# EAGLE design ADC_1_0 (EAGLE 7.6.0)
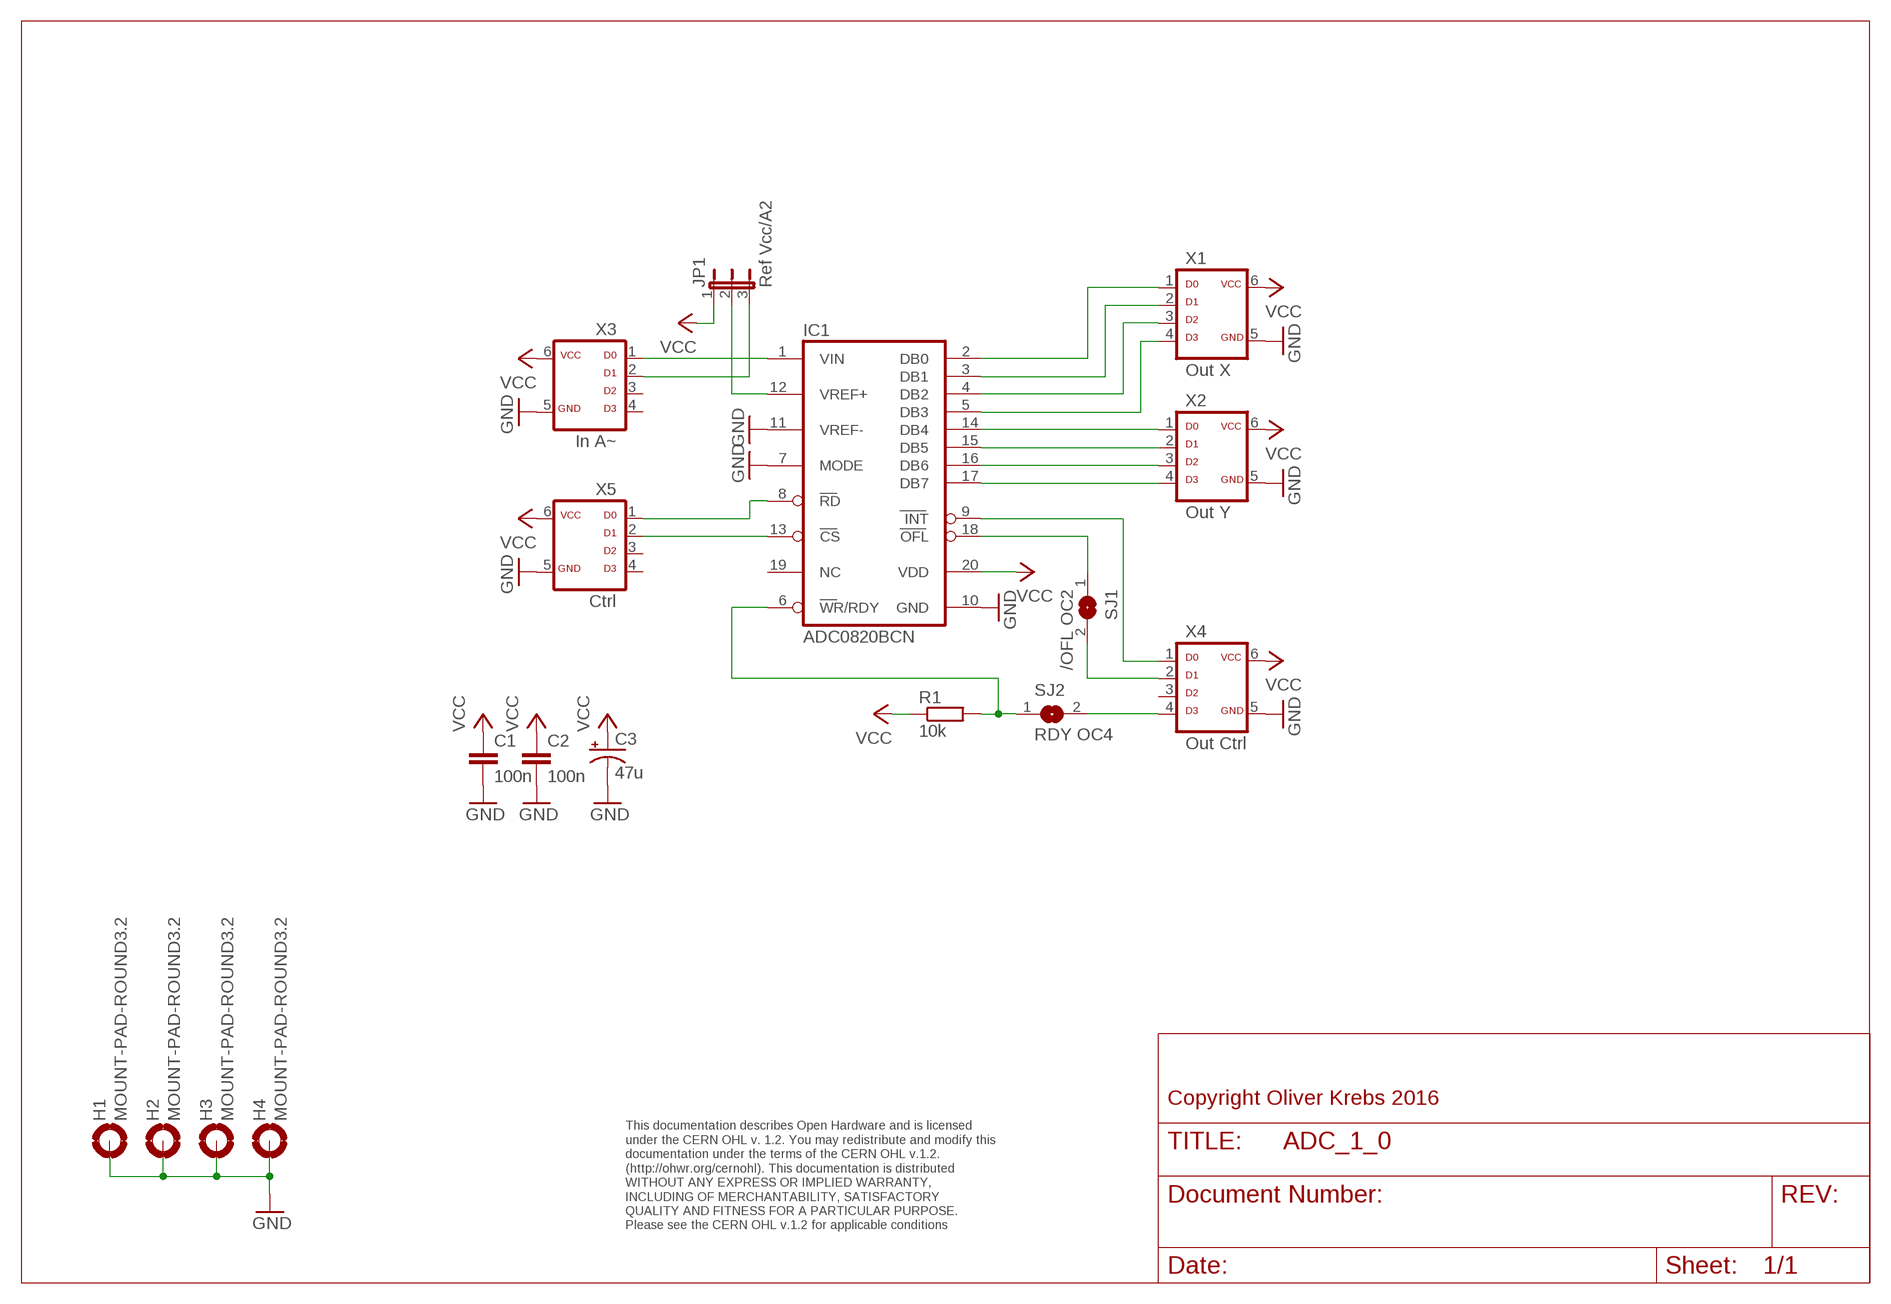
[diagram p0: schematic, sheet 1]

## Parts
C1  100n  CAPPTH1  [CAP-PTH-5MM]
C2  100n  CAPPTH1  [CAP-PTH-5MM]
C3  47u  CAP_POLPTH1  [CPOL-RADIAL-100UF-25V]
H1  MOUNT-PAD-ROUND3.2  [3,2-PAD]
H2  MOUNT-PAD-ROUND3.2  [3,2-PAD]
H3  MOUNT-PAD-ROUND3.2  [3,2-PAD]
H4  MOUNT-PAD-ROUND3.2  [3,2-PAD]
IC1  ADC0820BCN  [DIL20]
JP1  Ref Vcc/A2  JP2EJP2-U  [JP2-U]
R1  10k  R-EU_0207/10  [0207/10]
SJ1  /OFL OC2  SJ  [SJ]
SJ2  RDY OC4  SJ  [SJ]
X1  Out X  ML6D  [ML-6]
X2  Out Y  ML6D  [ML-6]
X3  In A~  ML6D  [ML-6]
X4  Out Ctrl  ML6D  [ML-6]
X5  Ctrl  ML6D  [ML-6]

## Nets
GND: C1.2 C2.2 C3.2(-) H1.B3,2(MOUNT) H2.B3,2(MOUNT) H3.B3,2(MOUNT) H4.B3,2(MOUNT) IC1.7(MODE) IC1.10(GND) IC1.11(VREF-) X1.5 X2.5 X3.5 X4.5 X5.5
N$1: IC1.9(INT) X4.1
N$2: SJ1.2 X4.2
N$3: IC1.2(DB0) X1.1
N$4: IC1.3(DB1) X1.2
N$5: IC1.4(DB2) X1.3
N$6: IC1.5(DB3) X1.4
N$7: IC1.14(DB4) X2.1
N$8: IC1.15(DB5) X2.2
N$9: IC1.16(DB6) X2.3
N$10: IC1.17(DB7) X2.4
N$11: IC1.1(VIN) X3.1
N$12: SJ2.2 X4.4
N$13: IC1.13(CS) X5.2
N$14: IC1.12(VREF+) JP1.2
N$15: IC1.8(RD) X5.1
N$16: JP1.3 X3.2
N$19: IC1.6(WR/RDY) R1.2 SJ2.1
N$20: IC1.18(OFL) SJ1.1
VCC: C1.1 C2.1 C3.1(+) IC1.20(VDD) JP1.1 R1.1 X1.6 X2.6 X3.6 X4.6 X5.6
Unconnected: IC1.19(NC) X3.3 X3.4 X4.3 X5.3 X5.4

## Notes on the sheet
- Copyright Oliver Krebs 2016
- This documentation describes Open Hardware and is licensed 
  under the CERN OHL v. 1.2. You may redistribute and modify this 
  documentation under the terms of the CERN OHL v.1.2. 
  (http://ohwr.org/cernohl). This documentation is distributed
  WITHOUT ANY EXPRESS OR IMPLIED WARRANTY, 
  INCLUDING OF MERCHANTABILITY, SATISFACTORY 
  QUALITY AND FITNESS FOR A PARTICULAR PURPOSE. 
  Please see the CERN OHL v.1.2 for applicable conditions

## Library data of the parts
C1 C2 = SparkFun-Passives:CAP: Capacitor Standard 0603 ceramic capacitor, and 0.1" leaded capacitor.
C3 = SparkFun-Passives:CAP_POL: Capacitor Polarized These are standard SMD and PTH capacitors. Normally 10uF, 47uF, and 100uF in electrolytic and tantalum varieties. Always verify the external diameter of the through hole cap, it varies with capacity, voltage, and manufacturer. The EIA devices should be standard.
H1-H4 = holes:MOUNT-PAD-ROUND: MOUNTING PAD, round
IC1 = maxim:ADC0820BCN: ANALOG/DIGITAL CONVERTER; MF: NATIONAL SEMICONDUCTOR; MPN: ADC0820CCN/NOPB.; OC_FARNELL: 1189415; OC_NEWARK: unknown
JP1 = 01-my-jumper:JP2E: JUMPER
R1 = 01-my_rcl:R-EU_: RESISTOR, European symbol
SJ1 SJ2 = 01-my-jumper:SJ: SMD solder JUMPER
X1-X5 = 01-my-con:ML6D

## Board
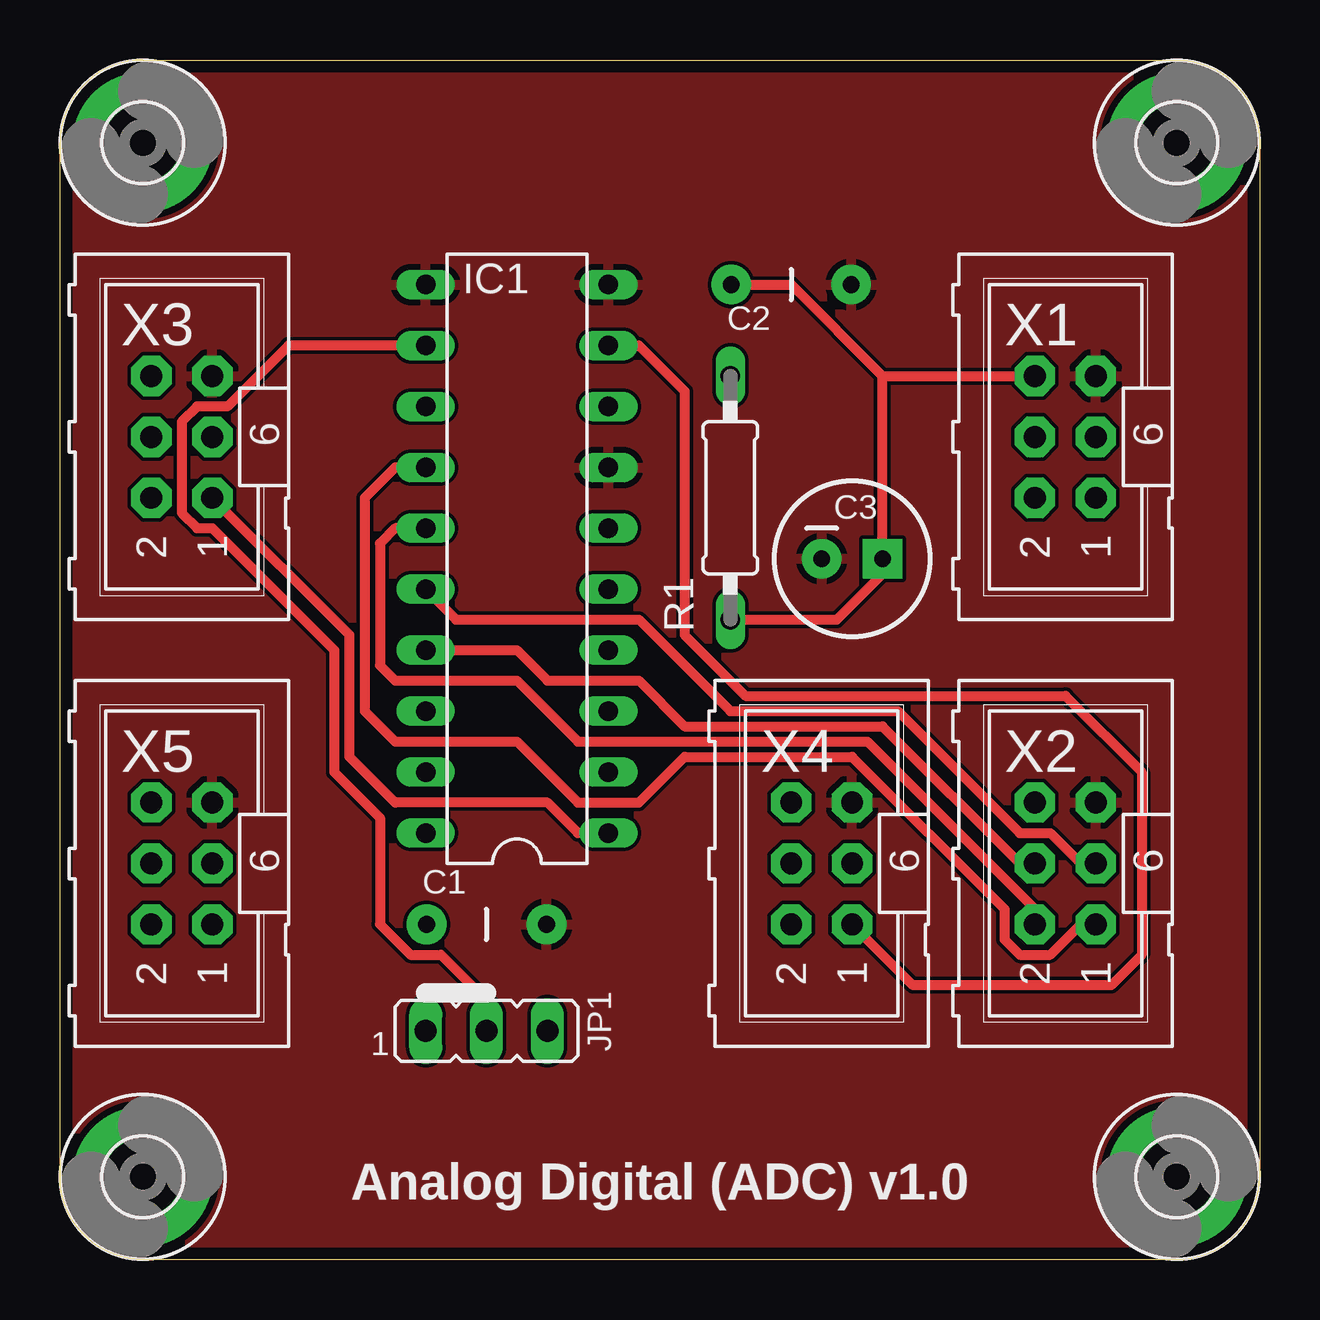
[diagram p1: board, top side]
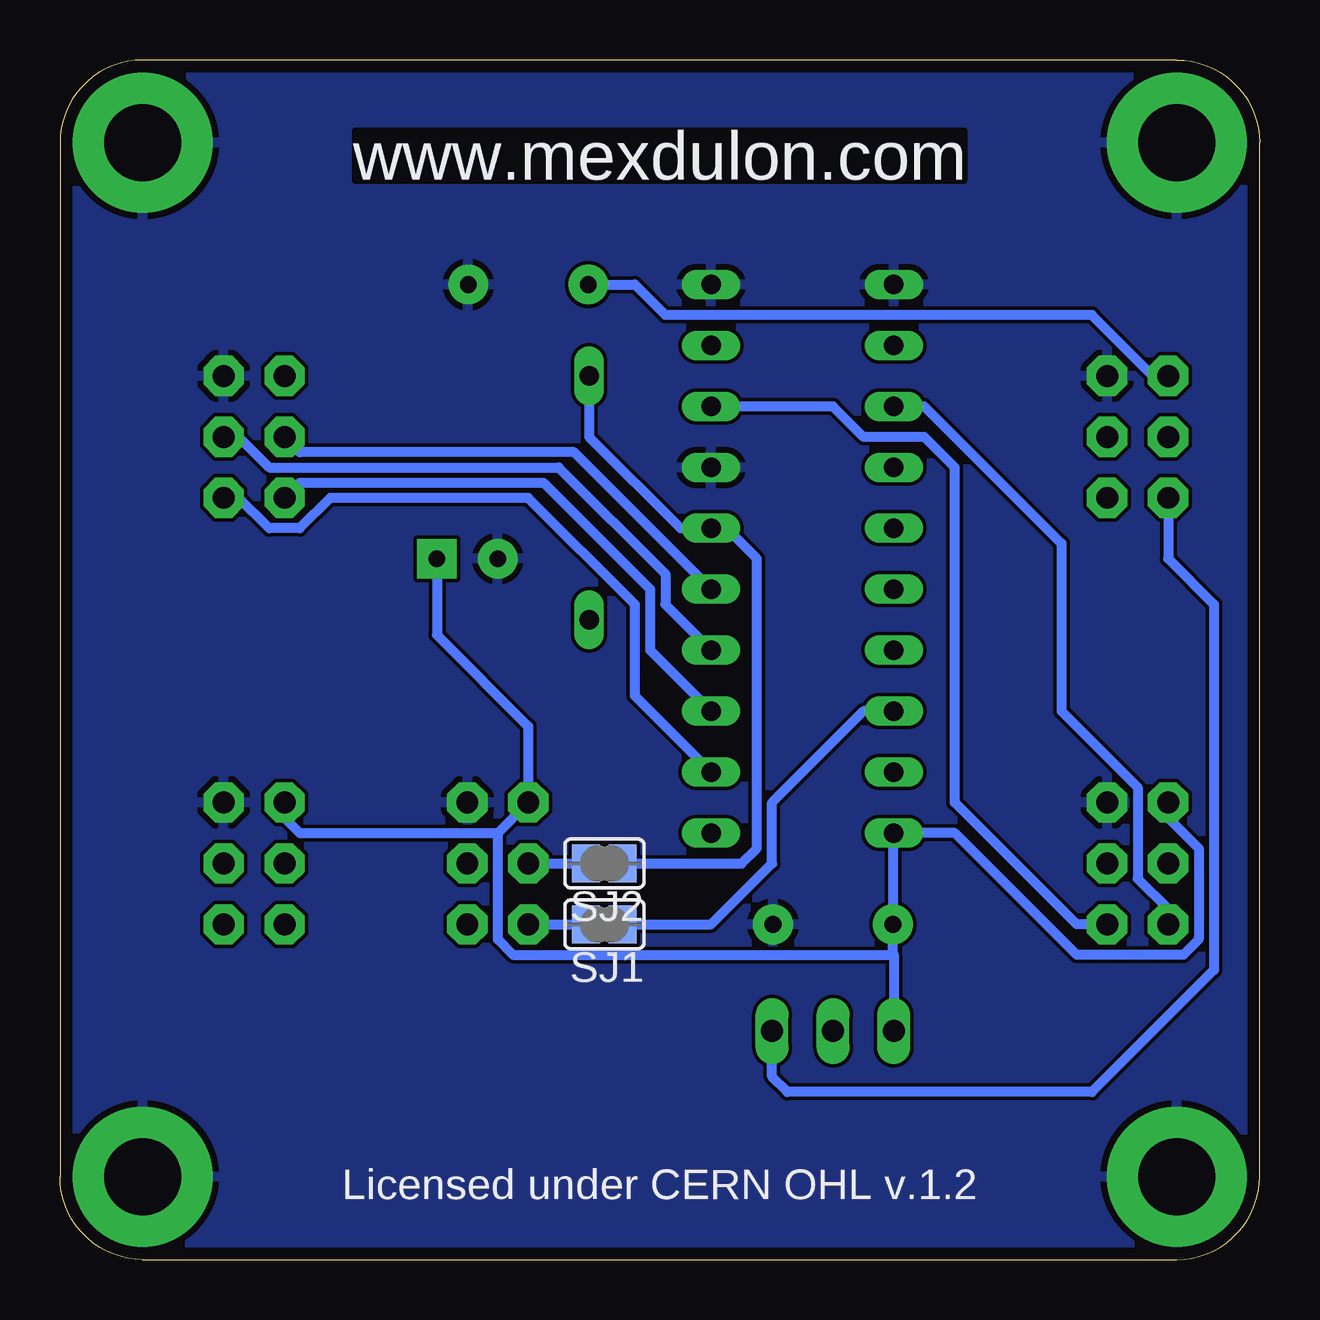
[diagram p2: board, bottom side, seen from below]

Size 50 x 50 mm. Coordinates in mm from the lower left corner, seen from the top.
Outline: 0,3.45 0,46.55 arc-90 3.45,50 46.55,50 arc-90 50,46.55 50,3.45 arc-90 46.55,0 3.45,0 arc-90 0,3.45
Copper layers (1*16): Top 0.035mm / dielectric 1.6mm / Bottom 0.035mm
Design rules "Elecrow_2-layer_PCB_eagle_rule": minimum track width 6mil, minimum drill 12mil, track to track 6mil, track to pad 6mil, pad to pad 6mil, via to via 8mil, smd to smd 0mil, copper to edge 20mil, drill to drill 10mil, minimum pad ring 6mil, minimum via ring 6mil, stop-mask expansion 0mil, vias tented up to drill 100mil, thermal gap 10mil

### Footprints (pad centres in the part's own frame; a part is rotated, then mirrored left to right if it is on the bottom)
CAP-PTH-5MM = drill 0.7 pad 1.651: 1 -2.5,0; 2 2.5,0
CPOL-RADIAL-100UF-25V = drill 0.7 pad 1.651 square: 1 1.27,0 | drill 0.7 pad 1.651: 2 -1.27,0
3,2-PAD = drill 3.2 pad 5.842: B3,2 0,0
DIL20 = drill 0.813 long: 1 -11.43,-3.81; 2 -8.89,-3.81; 3 -6.35,-3.81; 4 -3.81,-3.81; 5 -1.27,-3.81; 6 1.27,-3.81; 7 3.81,-3.81; 8 6.35,-3.81; 9 8.89,-3.81; 10 11.43,-3.81; 11 11.43,3.81; 12 8.89,3.81; 13 6.35,3.81; 14 3.81,3.81; 15 1.27,3.81; 16 -1.27,3.81; 17 -3.81,3.81; 18 -6.35,3.81; 19 -8.89,3.81; 20 -11.43,3.81
JP2-U = drill 0.914 long: 1 -2.54,0; 2 0,0; 3 2.54,0
0207/10 = drill 0.813 long: 1 -5.08,0; 2 5.08,0
SJ = smd 1.168 x 1.6: 1 -0.762,0; 2 0.762,0
ML-6 = drill 0.914 pad 1.676 octagon: 1 -2.54,-1.27; 2 -2.54,1.27; 3 0,-1.27; 4 0,1.27; 5 2.54,-1.27; 6 2.54,1.27

### Placement (x,y rotation side)
C1  17.78,13.97 0 top
C2  30.48,40.64 0 top
C3  33.02,29.21 0 top
H1  3.45,3.45 0 top
H2  3.45,46.55 0 top
H3  46.55,3.45 0 top
H4  46.55,46.55 0 top
IC1  19.05,29.21 90 top
JP1  17.78,9.53 0 top
R1  27.94,31.75 90 top
SJ1  27.3,13.97 180 bottom
SJ2  27.3,16.51 180 bottom
X1  41.91,34.29 90 top
X2  41.91,16.51 90 top
X3  5.08,34.29 90 top
X4  31.75,16.51 90 top
X5  5.08,16.51 90 top

### Tracks (layer width: path | path; a pad name or v marks a point on that pad's centre or on a via)
GND
  pour Bottom: 0,0 50.8,0 50.8,50.8 0,50.8
  pour Top: 0,50.16 50.16,50.16 50.16,0 0,0
N$1
  Top 0.406: IC1.9 24.13,38.1 26.04,36.2 26.04,26.04 28.57,23.5 41.91,23.5 45.09,20.32 45.09,12.7 43.81,11.43 35.56,11.43 X4.1
N$2
  Bottom 0.406: X4.2 SJ1.2
N$3
  Bottom 0.406: IC1.2 26.04,23.5 26.04,27.3 30.48,31.75 38.73,31.75 40.01,30.48 41.27,30.48 42.55,31.75 X1.1
N$4
  Bottom 0.406: X1.2 40.01,32.38 29.84,32.38 25.4,27.94 25.4,25.4 IC1.3
N$5
  Bottom 0.406: X1.3 42.55,34.29 41.27,33.02 29.21,33.02 24.77,28.57 24.77,27.3 IC1.4
N$6
  Bottom 0.406: IC1.5 28.57,33.66 40.01,33.66 X1.4
N$7
  Top 0.406: IC1.14 13.97,33.02 12.7,31.75 12.7,22.86 13.97,21.59 19.05,21.59 21.59,19.05 24.13,19.05 26.04,20.95 33.02,20.95 39.37,14.61 39.37,13.34 40.01,12.7 41.27,12.7 42.55,13.97 X2.1
N$8
  Top 0.406: IC1.15 13.97,30.48 13.34,29.84 13.34,24.77 13.97,24.13 19.05,24.13 21.59,21.59 33.66,21.59 40.64,14.61 X2.2
N$9
  Top 0.406: IC1.16 16.51,26.67 24.13,26.67 27.94,22.86 34.92,22.86 40.01,17.78 41.27,17.78 42.55,16.51 X2.3
N$10
  Top 0.406: IC1.17 19.05,25.4 20.32,24.13 24.13,24.13 26.04,22.23 34.29,22.23 40.01,16.51 X2.4
N$11
  Top 0.406: IC1.1 21.59,17.78 20.32,19.05 13.97,19.05 12.06,20.95 12.06,26.04 X3.1
N$12
  Bottom 0.406: X4.4 SJ2.2
N$13
  Bottom 0.406: IC1.13 13.97,35.56 8.26,29.84 8.26,22.86 5.08,19.68 5.08,15.88 3.81,14.61 X5.2
N$14
  Top 0.406: IC1.12 9.53,38.1 6.99,35.56 5.71,35.56 5.08,34.92 5.08,31.11 5.71,30.48 6.35,30.48 11.43,25.4 11.43,20.32 13.34,18.41 13.34,13.97 14.61,12.7 15.88,12.7 17.78,10.79 JP1.2
N$15
  Bottom 0.406: X5.1 7.62,13.97 12.7,19.05 12.7,33.02 13.97,34.29 16.51,34.29 17.78,35.56 IC1.8
N$16
  Bottom 0.406: X3.2 3.81,29.21 1.91,27.3 1.91,12.06 6.99,6.99 19.68,6.99 20.32,7.62 JP1.3
N$19
  Bottom 0.406: R1.2 27.94,34.29 24.13,30.48 IC1.6 22.23,30.48 20.95,29.21 20.95,17.14 21.59,16.51 SJ2.1
N$20
  Bottom 0.406: IC1.18 16.51,22.86 20.32,19.05 20.32,16.51 22.86,13.97 SJ1.1
VCC
  Top 0.406: C2.1 30.48,40.64 34.29,36.83 | 34.29,36.83 X1.6 | 34.29,36.83 C3.1 34.29,28.57 32.38,26.67 R1.1
  Bottom 0.406: C2.1 26.04,40.64 24.77,39.37 6.99,39.37 4.45,36.83 X3.6 | 31.75,17.78 31.75,13.34 31.11,12.7 15.28,12.7 | 31.75,17.78 X4.6 30.48,22.23 34.29,26.04 C3.1 | X2.6 40.64,18.41 40.01,17.78 31.75,17.78 | 15.28,12.7 C1.1 15.28,17.74 IC1.20 12.7,17.78 7.62,12.7 3.17,12.7 2.54,13.34 2.54,17.14 3.81,18.41 X5.6 | 15.28,12.7 15.24,12.7 JP1.1

### Text on the board
Bottom: www.mexdulon.com
tNames: Analog Digital (ADC) v1.0
bNames: www.mexdulon.com | Licensed under CERN OHL v.1.2